# Altium schematic sheet Power.SchDoc: Power
size A4
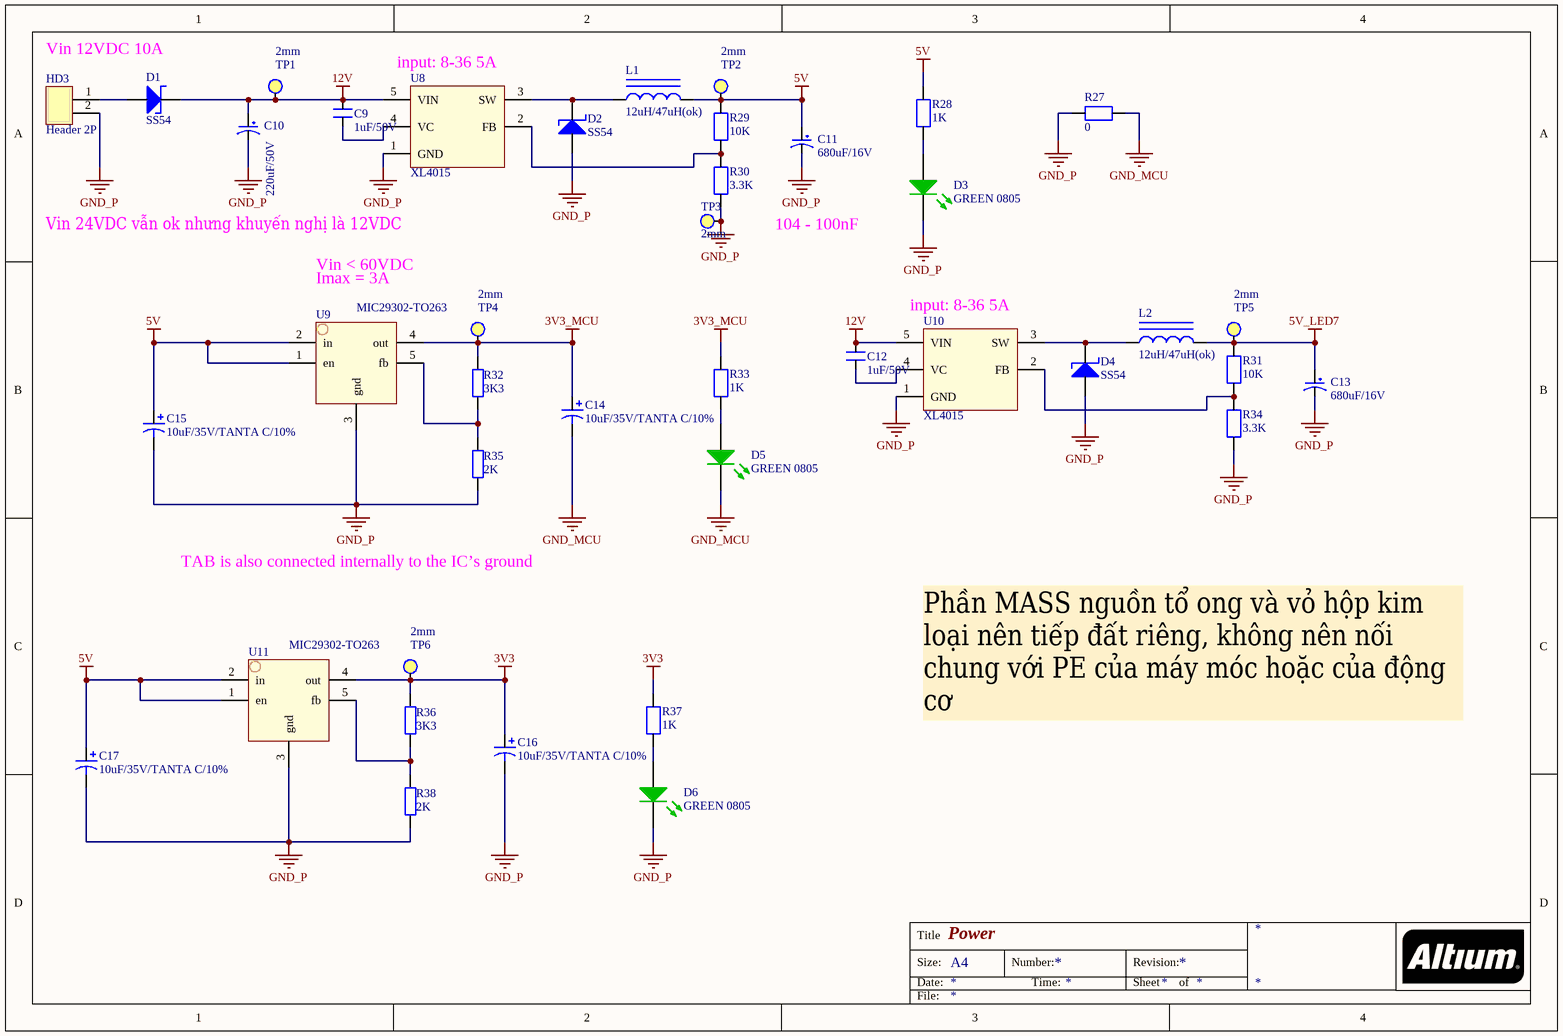
[diagram p0: Power.SchDoc]

## Parts
C9  1uF/50V  [Cap Ceramic 0805 SMD]
C10  220uF/50V  [CAP ALU CASE G SMD]
C11  680uF/16V  [CAP ALU CASE G SMD]
C12  1uF/50V  [Cap Ceramic 0805 SMD]
C13  680uF/16V  [CAP ALU CASE G SMD]
C14  10uF/35V/TANTA C/10%  [CAP TANT CASE C SMD]
C15  10uF/35V/TANTA C/10%  [CAP TANT CASE C SMD]
C16  10uF/35V/TANTA C/10%  [CAP TANT CASE C SMD]
C17  10uF/35V/TANTA C/10%  [CAP TANT CASE C SMD]
D1  SS54  [DO-214AB/SMC]
D2  SS54  [DO-214AB/SMC]
D3  GREEN 0805  [Led 0805G]
D4  SS54  [DO-214AB/SMC]
D5  GREEN 0805  [Led 0805G]
D6  GREEN 0805  [Led 0805G]
HD3  Header 2P  [2EDGR-5.08-02P]
L1  12uH/47uH(ok)  [POWER INDUCTOR]
L2  12uH/47uH(ok)  [POWER INDUCTOR]
R27  0  [Res 0805 SMD]
R28  1K  [Res 0805 SMD]
R29  10K  [Res 0805 SMD]
R30  3.3K  [Res 0805 SMD]
R31  10K  [Res 0805 SMD]
R32  3K3  [Res 0805 SMD]
R33  1K  [Res 0805 SMD]
R34  3.3K  [Res 0805 SMD]
R35  2K  [Res 0805 SMD]
R36  3K3  [Res 0805 SMD]
R37  1K  [Res 0805 SMD]
R38  2K  [Res 0805 SMD]
TP1  2mm  [Test Point 2mm]
TP2  2mm  [Test Point 2mm]
TP3  2mm  [Test Point 2mm]
TP4  2mm  [Test Point 2mm]
TP5  2mm  [Test Point 2mm]
TP6  2mm  [Test Point 2mm]
U8  XL4015  [TO-263-5P]
U9  MIC29302-TO263  [MIC29302-TO263]
U10  XL4015  [TO-263-5P]
U11  MIC29302-TO263  [MIC29302-TO263]

## Nets
3V3: C16.1 R36.2 R37.2 TP6.1 U11.4(out)
3V3_MCU: C14.1 R32.2 R33.2 TP4.1 U9.4(out)
5V: C11.1 C15.1 C17.1 L1.2 R28.2 R29.2 TP2.1 U9.1(en) U9.2(in) U11.1(en) U11.2(in)
5V_LED7: C13.1 L2.2 R31.2 TP5.1
12V: C9.1 C10.1 C12.1 D1.2(K) TP1.1 U8.5(VIN) U10.5(VIN)
GND_MCU: C14.2 D5.2(K) R27.1
GND_P: C10.2 C11.2 C13.2 C15.2 C16.2 C17.2 D2.1(A) D3.2(K) D4.1(A) D6.2(K) HD3.2 R27.2 R30.1 R34.1 R35.1 R38.1 TP3.1 U8.1(GND) U9.3(gnd) U10.1(GND) U11.3(gnd)
NetC9_2: C9.2 U8.4(VC)
NetC12_2: C12.2 U10.4(VC)
NetD1_1: D1.1(A) HD3.1
NetD2_2: D2.2(K) L1.1 U8.3(SW)
NetD3_1: D3.1(A) R28.1
NetD4_2: D4.2(K) L2.1 U10.3(SW)
NetD5_1: D5.1(A) R33.1
NetD6_1: D6.1(A) R37.1
NetR29_1: R29.1 R30.2 U8.2(FB)
NetR31_1: R31.1 R34.2 U10.2(FB)
NetR32_1: R32.1 R35.2 U9.5(fb)
NetR36_1: R36.1 R38.2 U11.5(fb)

## Notes on the sheet
- Vin 12VDC 10A
- (near U8) input: 8-36 5A
- Vin 24VDC vẫn ok nhưng khuyến nghị là 12VDC
- 104 - 100nF
- Vin < 60VDC
- Imax = 3A
- (near U10) input: 8-36 5A
- TAB is also connected internally to the IC’s ground
- Phần MASS nguồn tổ ong và vỏ hộp kim loại nên tiếp đất riêng, không nên nối chung với PE của máy móc hoặc của động cơ
- Title
- Size:
- Date:
- A4
- Number:
- Time:
- Revision:
- Sheet
- of
- File:

## Library data of the parts
C9 C12 = Cap Ceramic SMD: Buy Link: https://www.thegioiic.com/products/tu-1uf-50v-0805
C10 C11 C13 = Cap Alu SMD
  C10: Buy Link: https://www.thegioiic.com/products/tu-nhom-smd-220uf-50v-d10l10
C14-C17 = TAJB106M025RNJ: Tantalum Capacitors - Solid SMD 25v 10uF 20%Tol Code C; Manufacturer: Kyocera AVX; Tolerance: 20%; ESR (Equivalent Series Resistance): 2.5R; Leakage Current: 2.5uA; Polarity: Polar; Dissipation Factor: 6%; Supplier 1: Digi-Key; Manufacturer Part Number: TAJB106M025RNJ; Stock 1: 10615; Pricing 1: 1=0.74, 10=0.524, 100=0.3453, 500=0.2558, 1000=0.2174 (USD); Mount: Surface Mount; Case/Package: 1210; Weight: 0.000564oz; Case Code (Metric): 3528; Case Code (Imperial): 1210; Min Operating Temperature: -55°C; Max Operating Temperature: 125°C; Packaging: Tape and Reel; Capacitance: 10uF; Voltage Rating: 25V; Package Quantity: 2000; Termination: SMD/SMT; Voltage Rating (DC): 25V; Features: General Purpose; Length: 3.5mm; Height: 2.1mm; Width: 0.11inch; Height - Seated (Max): 0.083inch; Depth: 2.8mm; Lead Free: Lead Free; Supplier Part Number 1: 478-8887-1-ND; Buy Link: https://banlinhkien.com/tu-tantalum-106v10uf-35v-smd6032-p6650491.html
D1 D2 D4 = Diode Schottky
  D2 D4: Buy Link: https://www.thegioiic.com/products/ss54-smc
D3 D5 D6 = LED GREEN 0603: LED GREEN CLEAR 0603 SMD; Manufacturer: Lite-On Inc.; Manufacturer Part Number: LTST-C190KGKT; Lens Color: Colorless; Millicandela Rating: 35mcd; Lens Style/Size: Rectangle with Flat Top, 1.10mm x 0.80mm; Voltage - Forward (Vf) (Typ): 2V; Current - Test: 20mA; Viewing Angle: 130°; Wavelength - Dominant: 571nm; Wavelength - Peak: 574nm; RoHS: RoHS Compliant; Category: Optoelectronics; Packaging: Cut Tape (CT); Color: Green; Lens Transparency: Clear; Mounting Type: Surface Mount; Features: -; Package / Case: 0603 (1608 Metric); Supplier Device Package: *; Size / Dimension: 1.60mm L x 0.80mm W; Height (Max): 0.80mm; ComponentLink1URL: http://optoelectronics.liteon.com/upload/download/DS22-2000-074/S_110_LTST-C190KGKT.pdf; ComponentLink1Description: http://optoelectronics.liteon.com/upload/download/DS22-2000-074/S_110_LTST-C190KGKT.pdf; Supplier 1: Digi-Key; Supplier Part Number 1: 160-1435-1-ND; Buy Link: https://www.thegioiic.com/products/led-do-0805
L1 L2 = Power Inductor: CDRH127; Buy Link: https://www.thegioiic.com/products/cuon-cam-12uh-rh127-smd-12x12x7
R27-R31 R33 R34 R37 = Resistor: Buy Link: https://www.thegioiic.com/products?utf8=%E2%9C%93&search=%C4%91i%E1%BB%87n+tr%E1%BB%9F+0805
R32 R35 R36 R38 = R0805: Resistor SMD 0805; Published: 8-Jun-2000; LatestRevisionDate: 17-Jul-2002; LatestRevisionNote: Re-released for DXP Platform.; PackageReference: AXIAL-0.4; Publisher: Altium Limited
TP1-TP6 = Test Point: Test Point SMD
U8 U10 = XL4015: TO-263 5P; Buy Link: https://thegioiic.com/products/xl4015
U9 U11 = MIC29302: MIC29302 TO263 / High-Current Low-Dropout Regulators; Buy Link: https://thegioiic.com/products/mic29302